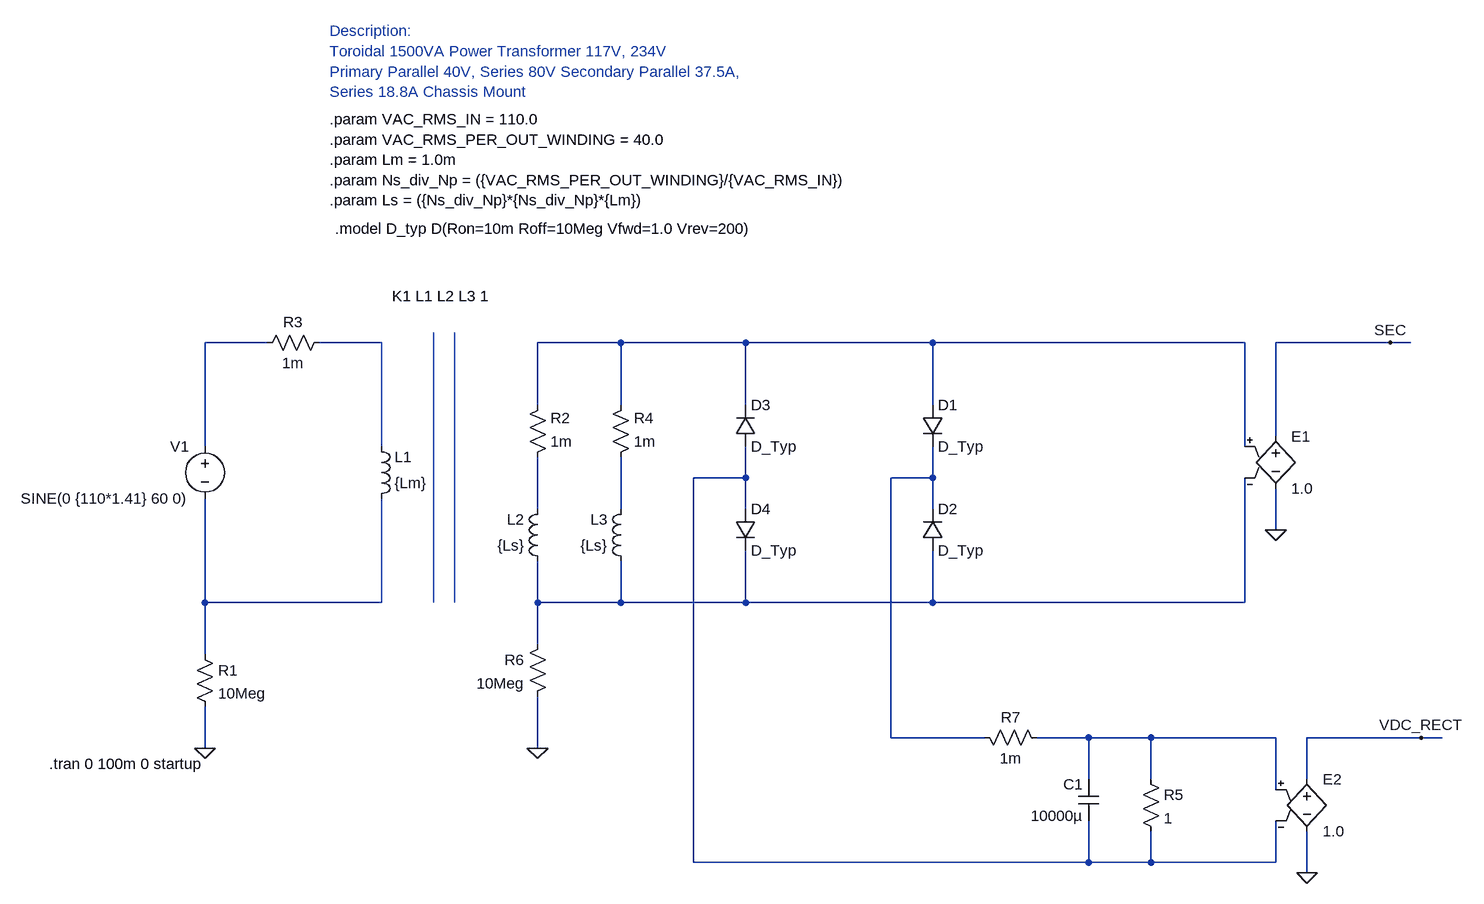
[diagram p0: schematic Mains_Voltage_AC_to_DC_Rectifier.asc]
Mains_Voltage_AC_to_DC_Rectifier.asc, the LTspice schematic file:
Version 4.1
SHEET 1 1808 944
WIRE -48 16 -144 16
WIRE 128 16 32 16
WIRE 496 16 368 16
WIRE 688 16 496 16
WIRE 976 16 688 16
WIRE 1456 16 976 16
WIRE 1680 16 1504 16
WIRE 1712 16 1680 16
WIRE 368 112 368 16
WIRE 496 112 496 16
WIRE 688 112 688 16
WIRE 976 112 976 16
WIRE 1504 160 1504 16
WIRE -144 176 -144 16
WIRE 128 176 128 16
WIRE 1456 176 1456 16
WIRE 688 224 688 176
WIRE 688 224 608 224
WIRE 976 224 976 176
WIRE 976 224 912 224
WIRE 368 272 368 192
WIRE 496 272 496 192
WIRE 688 272 688 224
WIRE 976 272 976 224
WIRE 1504 304 1504 240
WIRE -144 416 -144 256
WIRE 128 416 128 256
WIRE 128 416 -144 416
WIRE 368 416 368 352
WIRE 496 416 496 352
WIRE 496 416 368 416
WIRE 688 416 688 336
WIRE 688 416 496 416
WIRE 976 416 976 336
WIRE 976 416 688 416
WIRE 1456 416 1456 224
WIRE 1456 416 976 416
WIRE 368 480 368 416
WIRE -144 496 -144 416
WIRE 912 624 912 224
WIRE 1056 624 912 624
WIRE 1216 624 1136 624
WIRE 1312 624 1216 624
WIRE 1504 624 1312 624
WIRE 1728 624 1552 624
WIRE 1760 624 1728 624
WIRE -144 640 -144 576
WIRE 368 640 368 560
WIRE 1216 688 1216 624
WIRE 1312 688 1312 624
WIRE 1552 688 1552 624
WIRE 1504 704 1504 624
WIRE 608 816 608 224
WIRE 1216 816 1216 752
WIRE 1216 816 608 816
WIRE 1312 816 1312 768
WIRE 1312 816 1216 816
WIRE 1504 816 1504 752
WIRE 1504 816 1312 816
WIRE 1552 832 1552 768
FLAG -144 640 0
FLAG 1504 304 0
FLAG 1680 16 SEC
FLAG 1552 832 0
FLAG 1728 624 VDC_RECT
FLAG 368 640 0
SYMBOL ind 112 272 M180
WINDOW 0 36 80 Left 2
WINDOW 3 36 40 Left 2
SYMATTR InstName L1
SYMATTR Value {Lm}
SYMATTR Type ind
SYMBOL ind 384 368 R180
WINDOW 0 36 80 Left 2
WINDOW 3 36 40 Left 2
SYMATTR InstName L2
SYMATTR Value {Ls}
SYMATTR Type ind
SYMBOL ind 512 368 R180
WINDOW 0 36 80 Left 2
WINDOW 3 36 40 Left 2
SYMATTR InstName L3
SYMATTR Value {Ls}
SYMATTR Type ind
SYMBOL voltage -144 160 M0
WINDOW 123 0 0 Left 0
WINDOW 39 0 0 Left 0
SYMATTR InstName V1
SYMATTR Value SINE(0 {110*1.41} 60 0)
SYMBOL res -160 480 R0
SYMATTR InstName R1
SYMATTR Value 10Meg
SYMBOL res -64 32 R270
WINDOW 0 32 56 VTop 2
WINDOW 3 0 56 VBottom 2
SYMATTR InstName R3
SYMATTR Value 1m
SYMBOL e 1504 144 R0
SYMATTR InstName E1
SYMATTR Value 1.0
SYMBOL res 352 208 M180
WINDOW 0 36 76 Left 2
WINDOW 3 36 40 Left 2
SYMATTR InstName R2
SYMATTR Value 1m
SYMBOL res 480 208 M180
WINDOW 0 36 76 Left 2
WINDOW 3 36 40 Left 2
SYMATTR InstName R4
SYMATTR Value 1m
SYMBOL diode 960 112 R0
SYMATTR InstName D1
SYMATTR Value D_Typ
SYMBOL diode 960 336 M180
WINDOW 0 24 64 Left 2
WINDOW 3 24 0 Left 2
SYMATTR InstName D2
SYMATTR Value D_Typ
SYMBOL diode 672 176 M180
WINDOW 0 24 64 Left 2
WINDOW 3 24 0 Left 2
SYMATTR InstName D3
SYMATTR Value D_Typ
SYMBOL diode 672 272 R0
SYMATTR InstName D4
SYMATTR Value D_Typ
SYMBOL cap 1232 688 M0
SYMATTR InstName C1
SYMATTR Value 10000µ
SYMBOL res 1296 672 R0
SYMATTR InstName R5
SYMATTR Value 1
SYMBOL e 1552 672 R0
SYMATTR InstName E2
SYMATTR Value 1.0
SYMBOL res 384 464 M0
SYMATTR InstName R6
SYMATTR Value 10Meg
SYMBOL res 1040 608 M90
WINDOW 0 0 56 VBottom 2
WINDOW 3 32 56 VTop 2
SYMATTR InstName R7
SYMATTR Value 1m
TEXT 48 -464 Left 2 ;Description:\nToroidal 1500VA Power Transformer 117V, 234V\nPrimary Parallel 40V, Series 80V Secondary Parallel 37.5A,\nSeries 18.8A Chassis Mount
TEXT 48 -328 Left 2 !.param VAC_RMS_IN = 110.0\n.param VAC_RMS_PER_OUT_WINDING = 40.0\n.param Lm = 1.0m\n.param Ns_div_Np = ({VAC_RMS_PER_OUT_WINDING}/{VAC_RMS_IN})\n.param Ls = ({Ns_div_Np}*{Ns_div_Np}*{Lm})
TEXT 144 -56 Left 2 !K1 L1 L2 L3 1
TEXT -384 664 Left 2 !.tran 0 100m 0 startup
TEXT 56 -160 Left 2 !.model D_typ D(Ron=10m Roff=10Meg Vfwd=1.0 Vrev=200)
LINE Normal 208 416 208 0
LINE Normal 240 416 240 0

The netlist it stands for:
* Mains_Voltage_AC_to_DC_Rectifier.asc
L1 N008 N002 {Lm}
L2 N009 N006 {Ls}
L3 N009 N007 {Ls}
V1 N001 N008 SINE(0 {110*1.41} 60 0)
R1 N008 0 10Meg
R3 N001 N002 1m
E1 SEC 0 N003 N009 1.0
R2 N006 N003 1m
R4 N007 N003 1m
D1 N003 N005 D_Typ
D2 N009 N005 D_Typ
D3 N004 N003 D_Typ
D4 N004 N009 D_Typ
C1 N010 N004 10000µ
R5 N010 N004 1
E2 VDC_RECT 0 N010 N004 1.0
R6 N009 0 10Meg
R7 N005 N010 1m
.model D D
.lib standard.dio
* Description:
* Toroidal 1500VA Power Transformer 117V, 234V
* Primary Parallel 40V, Series 80V Secondary Parallel 37.5A,
* Series 18.8A Chassis Mount
.param VAC_RMS_IN = 110.0
.param VAC_RMS_PER_OUT_WINDING = 40.0
.param Lm = 1.0m
.param Ns_div_Np = ({VAC_RMS_PER_OUT_WINDING}/{VAC_RMS_IN})
.param Ls = ({Ns_div_Np}*{Ns_div_Np}*{Lm})
K1 L1 L2 L3 1
.tran 0 100m 0 startup
.model D_typ D(Ron=10m Roff=10Meg Vfwd=1.0 Vrev=200)
.backanno
.end